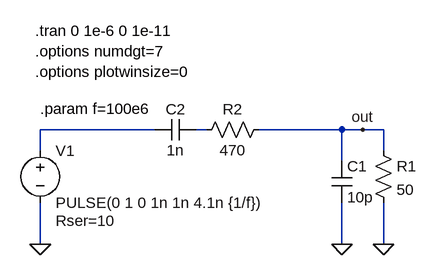
[diagram p0: schematic harmonics.asc]
harmonics.asc, the LTspice schematic file:
Version 4
SHEET 1 880 680
WIRE 208 64 32 64
WIRE 288 64 272 64
WIRE 496 64 368 64
WIRE 528 64 496 64
WIRE 560 64 528 64
WIRE 32 96 32 64
WIRE 560 96 560 64
WIRE 496 112 496 64
WIRE 32 240 32 176
WIRE 496 240 496 176
WIRE 560 240 560 176
FLAG 32 240 0
FLAG 560 240 0
FLAG 528 64 out
FLAG 496 240 0
SYMBOL voltage 32 80 R0
WINDOW 123 0 0 Left 0
WINDOW 39 24 124 Left 2
SYMATTR InstName V1
SYMATTR Value PULSE(0 1 0 1n 1n 4.1n {1/f})
SYMATTR SpiceLine Rser=10
SYMBOL res 544 80 R0
SYMATTR InstName R1
SYMATTR Value 50
SYMBOL res 384 48 R90
WINDOW 0 0 56 VBottom 2
WINDOW 3 32 56 VTop 2
SYMATTR InstName R2
SYMATTR Value 470
SYMBOL cap 480 112 R0
SYMATTR InstName C1
SYMATTR Value 10p
SYMBOL cap 272 48 R90
WINDOW 0 0 32 VBottom 2
WINDOW 3 32 32 VTop 2
SYMATTR InstName C2
SYMATTR Value 1n
TEXT 32 32 Left 2 !.param f=100e6
TEXT 24 -88 Left 2 !.tran 0 1e-6 0 1e-11\n.options numdgt=7\n.options plotwinsize=0

The netlist it stands for:
* harmonics.asc
V1 N001 0 PULSE(0 1 0 1n 1n 4.1n {1/f}) Rser=10
R1 out 0 50
R2 out N002 470
C1 out 0 10p
C2 N002 N001 1n
.param f=100e6
.tran 0 1e-6 0 1e-11
.options numdgt=7
.options plotwinsize=0
.backanno
.end